# EAGLE design max17222evk (EAGLE 8.2.1)
AUTHOR: Joshua Adkins; REV: A; TITLE: MAX17222EVK
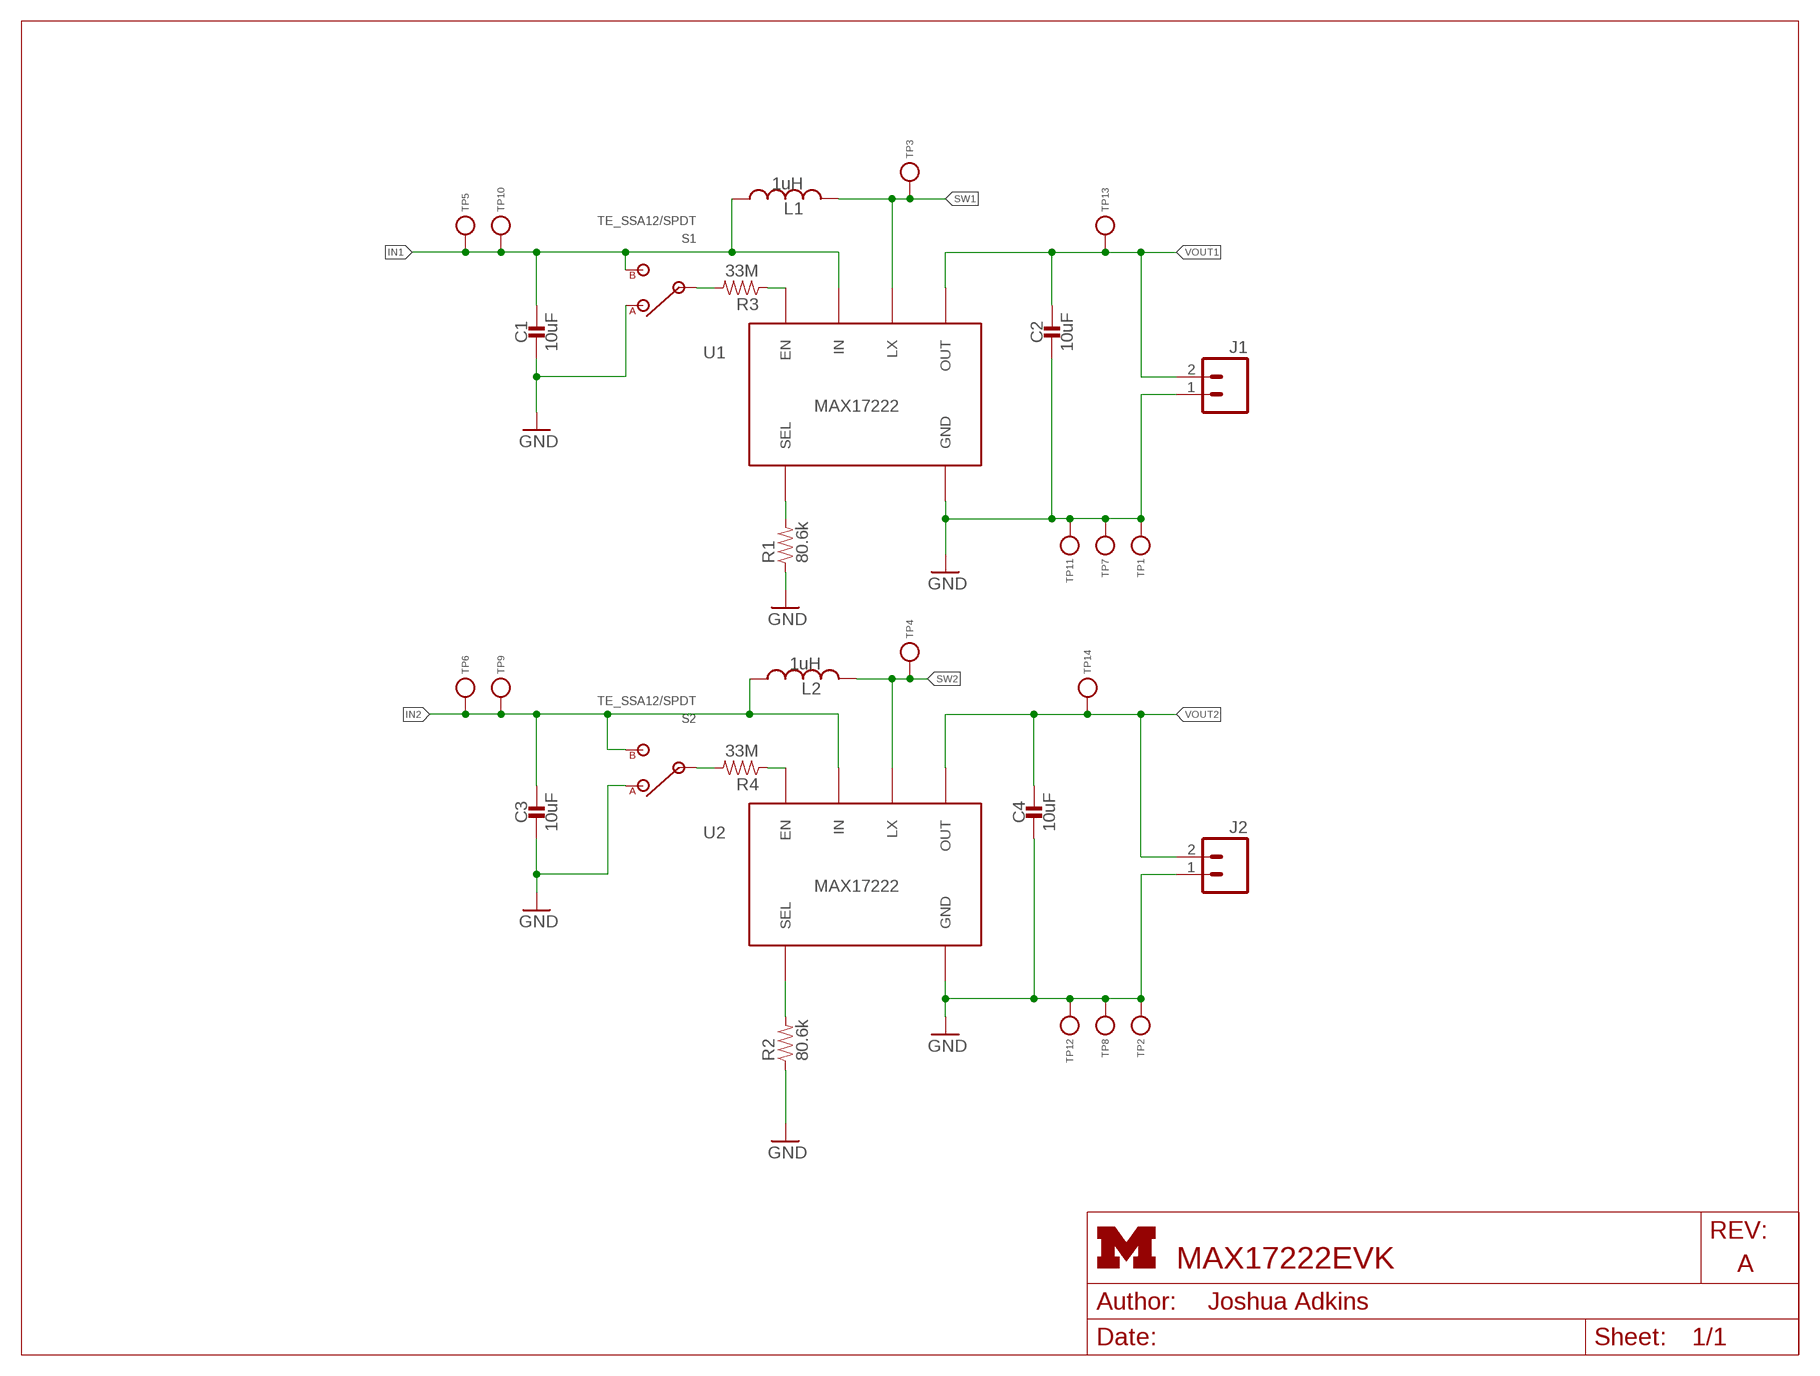
[diagram p0: schematic, sheet 1]
FRAME1 (LETTER_L_UMICH): HEIGHT: 8.5in; WIDTH: 11in

## Parts
C1  10uF  CAPACITOR0603_CAP  [0603_CAP]
C2  10uF  CAPACITOR0603_CAP  [0603_CAP]
C3  10uF  CAPACITOR0603_CAP  [0603_CAP]
C4  10uF  CAPACITOR0603_CAP  [0603_CAP]
J1  M023.5MM  [SCREWTERMINAL-3.5MM-2]
J2  M023.5MM  [SCREWTERMINAL-3.5MM-2]
L1  1uH  INDUCTORIHL2525CZ  [IHL-2525CZ]
L2  1uH  INDUCTORDFE322512C  [DFE322512C]
R1  80.6k  RESISTOR0603_RES  [0603-RES]
R2  80.6k  RESISTOR0603_RES  [0603-RES]
R3  33M  RESISTOR0603_RES  [0603-RES]
R4  33M  RESISTOR0603_RES  [0603-RES]
S1  TE_SSA12/SPDT  [TE_SSA12/SPDT]
S2  TE_SSA12/SPDT  [TE_SSA12/SPDT]
TP1  TEST_POINT_0.112IN  [TESTPOINT_0.112IN]
TP2  TEST_POINT_0.112IN  [TESTPOINT_0.112IN]
TP3  TEST_POINT_0.040IN  [TESTPOINT_0.040IN]
TP4  TEST_POINT_0.040IN  [TESTPOINT_0.040IN]
TP5  TEST_POINT_0.040IN  [TESTPOINT_0.040IN]
TP6  TEST_POINT_0.040IN  [TESTPOINT_0.040IN]
TP7  TEST_POINT_0.040IN  [TESTPOINT_0.040IN]
TP8  TEST_POINT_0.040IN  [TESTPOINT_0.040IN]
TP9  TEST_POINT_0.040IN  [TESTPOINT_0.040IN]
TP10  TEST_POINT_0.040IN  [TESTPOINT_0.040IN]
TP11  TEST_POINT_0.112IN  [TESTPOINT_0.112IN]
TP12  TEST_POINT_0.112IN  [TESTPOINT_0.112IN]
TP13  TEST_POINT_0.040IN  [TESTPOINT_0.040IN]
TP14  TEST_POINT_0.040IN  [TESTPOINT_0.040IN]
U1  MAX17222  [UDFN-6-MAXIM]
U2  MAX17222  [UDFN-6-MAXIM]

## Nets
GND: C1.2 C2.2 C3.2 C4.2 J1.1 J2.1 R1.1 R2.1 S1.1(A) S2.1(A) TP1.1(TESTPOINT) TP2.1(TESTPOINT) TP7.TESTPOINT TP8.TESTPOINT TP11.1(TESTPOINT) TP12.1(TESTPOINT) U1.3(GND) U2.3(GND)
IN1: C1.1 L1.P$1 S1.2(B) TP5.TESTPOINT TP10.TESTPOINT U1.5(IN)
IN2: C3.1 L2.P$1 S2.2(B) TP6.TESTPOINT TP9.TESTPOINT U2.5(IN)
N$1: R3.2 S1.IN
N$2: R3.1 U1.6(EN)
N$3: R4.2 S2.IN
N$4: R4.1 U2.6(EN)
N$5: R1.2 U1.4(SEL)
N$12: R2.2 U2.4(SEL)
SW1: L1.P$2 TP3.TESTPOINT U1.2(LX)
SW2: L2.P$2 TP4.TESTPOINT U2.2(LX)
VOUT1: C2.1 J1.2 TP13.TESTPOINT U1.1(OUT)
VOUT2: C4.1 J2.2 TP14.TESTPOINT U2.1(OUT)

## Library data of the parts
C1-C4 = passives:CAPACITOR: SMD Capacitor; DIGIKEY: 490-3896-2-ND
J1 J2 = SparkFun-Connectors:M02: Header 2 Standard 2-pin 0.1" header. Use with straight break away headers (SKU : PRT-00116), right angle break away headers (PRT-00553), swiss pins (PRT-00743), machine pins (PRT-00117), and female headers (PRT-00115). Molex polarized connector foot print use with SKU : PRT-08233 with associated crimp pins and housings.; DIGIKEY: 277-1721-ND
L1 = passives:INDUCTOR: A very specific inductor; DIGIKEY: 541-2562-1-ND
L2 = passives:INDUCTOR: A very specific inductor; DIGIKEY: 490-10590-1-ND
R1 R2 = passives:RESISTOR: Resistor Basic schematic elements and footprints for 0603, 1206, and PTH resistors.; DIGIKEY: 311-80.6KHRCT-ND
R3 R4 = passives:RESISTOR: Resistor Basic schematic elements and footprints for 0603, 1206, and PTH resistors.; DIGIKEY: HMC0603JT33M0CT-ND
S1 S2 = switches:TE_SSA12/SPDT: SWITCH SLIDE SPDT 2POS SSA SER; DIGIKEY: 450-1602-ND
TP1 TP2 TP11 TP12 = headers:TEST_POINT_0.112IN: Solder terminal, turreted; DIGIKEY: 36-1519-2-ND; NEWARK: 40F6015
TP3-TP10 TP13 TP14 = headers:TEST_POINT_0.040IN: 0.040in Test Point; DIGIKEY: 5001K-ND
U1 U2 = chips:MAX17222: Very high efficiency, very low power boost converter suitable for EH applications; DIGIKEY: MAX17222ELT+TCT-ND; MANUFACTURER: MAXIM INTEGRATED; MANUFACTURER_PN: MAX17222ELT+T

## Board
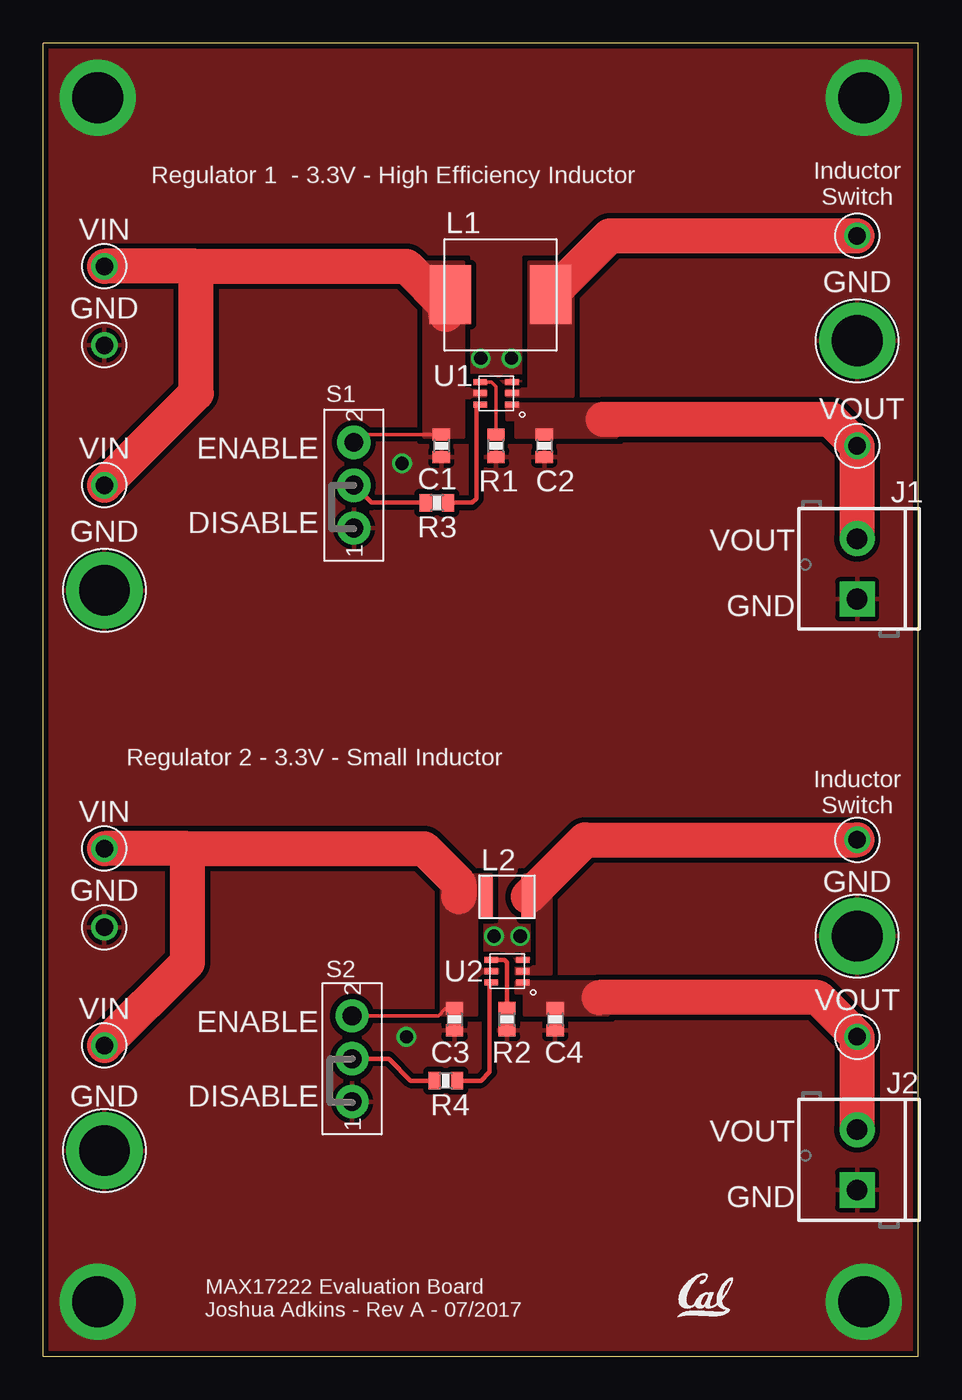
[diagram p1: board, top side]
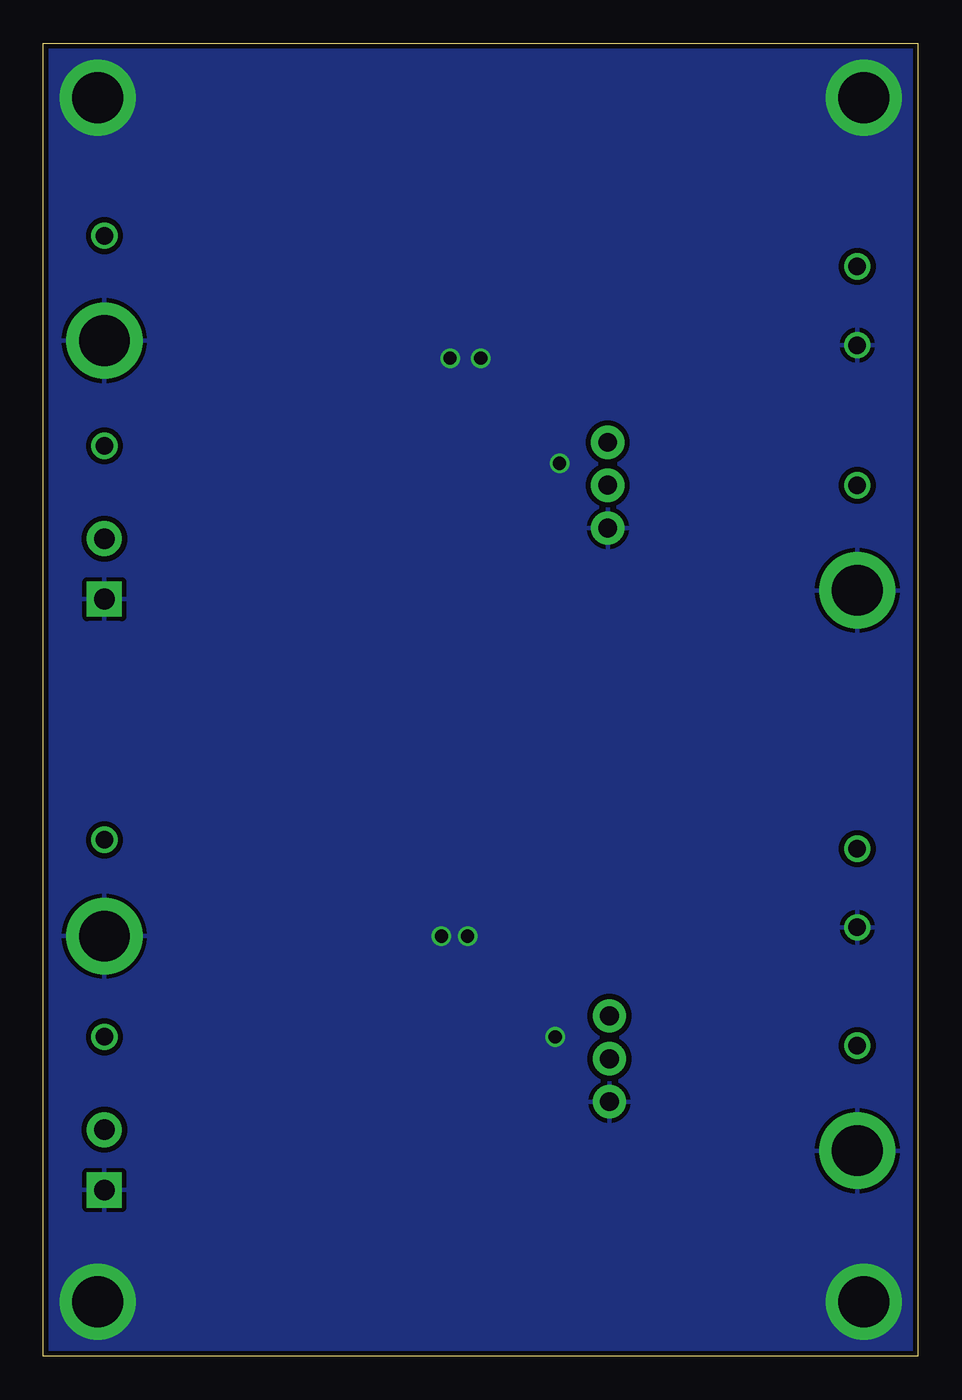
[diagram p2: board, bottom side, seen from below]

Size 50.8 x 76.2 mm. Coordinates in mm from the lower left corner, seen from the top.
Outline: 0,0 50.8,0 50.8,76.2 0,76.2 0,0
Copper layers (1*16): Top 0.0178mm / dielectric 59mil / Bottom 0.0178mm
Design rules "quickturn_co_kr_1oz": minimum track width 4mil, minimum drill 0.200659375mm, track to track 6mil, track to pad 6mil, pad to pad 6mil, via to via 6mil, smd to smd 6mil, copper to edge 12mil, drill to drill 12mil, minimum pad ring 8mil, minimum via ring 4mil, stop-mask expansion 3mil, vias tented up to drill 50mil, thermal gap 10mil

### Footprints (pad centres in the part's own frame; a part is rotated, then mirrored left to right if it is on the bottom)
0603_CAP = smd 0.7 x 1: 1 -0.65,0; 2 0.65,0
SCREWTERMINAL-3.5MM-2 = drill 1.2 pad 2.032 square: 1 0,0 | drill 1.2 pad 2.032: 2 3.5,0
IHL-2525CZ = smd 2.413 x 3.429: P$1 -2.921,0; P$2 2.921,0
DFE322512C = smd 0.75 x 2.5: P$1 1.225,0; P$2 -1.225,0
0603-RES = smd 0.7 x 1: 1 -0.65,0; 2 0.65,0
TE_SSA12/SPDT = drill 1.092 pad 1.93: 1 -2.489,0; 2 2.489,0; IN 0,0
TESTPOINT_0.112IN = drill 2.946: 1 0,0
TESTPOINT_0.040IN = drill 1.016: TESTPOINT 0,0
UDFN-6-MAXIM = smd 0.8 x 0.35: 1 -0.915,0.65; 2 -0.915,0; 3 -0.915,-0.65; 4 0.915,-0.65; 5 0.915,0; 6 0.915,0.65

### Placement (x,y rotation side)
C1  23.11,52.83 270 top
C2  29.08,52.83 270 top
C3  23.88,19.56 270 top
C4  29.72,19.56 270 top
J1  47.24,43.94 90 top
J2  47.24,9.65 90 top
L1  26.54,61.59 0 top
L2  26.92,26.67 180 top
R1  26.29,52.83 90 top
R2  26.92,19.56 90 top
R3  22.86,49.53 180 top
R4  23.37,16 180 top
S1  18.03,50.55 90 top
S2  17.93,17.27 90 top
TP1  47.24,24.38 0 top
TP2  47.24,58.93 0 top
TP3  47.24,65.02 0 top
TP4  47.24,29.97 0 top
TP5  3.56,50.55 0 top
TP6  3.56,29.46 0 top
TP7  3.56,24.89 0 top
TP8  3.56,58.67 0 top
TP9  3.56,18.03 0 top
TP10  3.56,63.25 0 top
TP11  3.56,44.45 0 top
TP12  3.56,11.94 0 top
TP13  47.24,52.83 0 top
TP14  47.24,18.54 0 top
U1  26.29,55.88 180 top
U2  26.92,22.35 180 top
U$1  [UCB_CAL_100MIL]  36.83,2.29 0 top

### Tracks (layer width: path | path; a pad name or v marks a point on that pad's centre or on a via)
GND  (via drill 0.76, 2.95)
  other vias: 26.16,24.38 27.69,24.38 25.4,57.91 27.18,57.91 21.08,18.54 20.83,51.82 3.17,3.17 47.62,3.17 47.62,73.03 3.17,73.03
  pour Bottom (isolate 0.305, rank 2): 0,-0.13 0,76.33 51.18,76.33 51.05,-0.13
  pour Top (isolate 0.305, rank 2): 0,-0.13 0,76.45 51.05,76.33 51.05,-0.13
IN1
  Top 0.203: S1.2 18.48,53.48 C1.1
  Top 2.032: 8.89,63.25 TP10.TESTPOINT | 8.89,63.25 21.08,63.25 23.37,60.96 23.37,60.45 | TP5.TESTPOINT 8.89,55.88 8.89,63.25
  pour Top (isolate 0.203, no thermals): 25.65,55.63 24.38,55.63 24.38,53.34 22.1,53.34 22.1,63.5 24.38,63.5 24.38,56.13 25.65,56.13
IN2
  Top 0.203: C3.1 23.86,20.19 23.37,20.19 22.94,19.76 S2.2
  Top 2.032: 8.38,29.46 22.1,29.46 24.13,27.43 24.13,26.67 | 8.38,29.46 TP6.TESTPOINT | TP9.TESTPOINT 8.38,22.86 8.38,29.46
  pour Top (isolate 0.305, no thermals): 26.42,22.1 25.15,22.1 25.15,19.81 23.11,19.81 23.11,27.94 26.04,27.94 26.04,25.53 25.15,25.53 25.15,22.61 26.42,22.61
N$1
  Top 0.254: S1.IN 19.05,49.53 R3.2
N$2
  Top 0.254: R3.1 24.89,49.53 25.15,49.78 25.15,55 U1.6
N$3
  Top 0.254: R4.2 21.34,16 20.07,17.27 S2.IN
N$4
  Top 0.254: R4.1 25.4,16 25.91,16.51 25.91,21.6 U2.6
N$5
  Top 0.203: R1.2 26.29,56.26 26.02,56.53 U1.4
N$12
  Top 0.254: R2.2 26.92,22.86 26.78,23 U2.4
SW1
  Top 2.032: L1.P$2 32.89,65.02 TP3.TESTPOINT
  pour Top (isolate 0.203, no thermals): 26.92,55.73 30.73,55.73 30.73,63.5 28.19,63.5 28.19,56.13 26.92,56.13
SW2
  Top 2.032: L2.P$2 31.45,29.97 TP4.TESTPOINT
  pour Top (isolate 0.203, no thermals): 27.43,22.2 27.43,22.61 28.7,22.61 28.7,25.53 27.94,25.53 27.94,27.94 29.46,27.94 29.46,22.2
VOUT1
  Top 2.032: J1.2 TP13.TESTPOINT 45.72,54.36 32.51,54.36
  pour Top (isolate 0.203, no thermals): 26.92,54.36 26.92,55.24 33.27,55.24 33.27,53.34 27.43,53.34 27.43,54.36
VOUT2
  Top 2.032: J2.2 TP14.TESTPOINT 44.96,20.83 32.26,20.83
  pour Top (isolate 0.203, no thermals): 27.43,21.72 27.43,21.08 27.94,21.08 27.94,19.81 32.77,19.81 32.77,21.72

### Text on the board
tPlace: Regulator 1 - 3.3V - High Efficiency Inductor | Inductor / Switch | VIN | GND | GND | VOUT | VIN | ENABLE | DISABLE | GND | VOUT | GND | Regulator 2 - 3.3V - Small Inductor | VIN | Inductor / Switch | GND | GND | VIN | VOUT | ENABLE | GND | DISABLE | VOUT | GND | MAX17222 Evaluation Board / Joshua Adkins - Rev A - 07/2017